# Altium schematic sheet LED MODULE.SchDoc
size A4
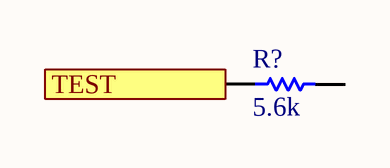
[diagram p0: LED MODULE.SchDoc]

## Parts
R?  5.6k  [0805]

## Ports
TEST

## Nets
TEST: R?.1 ; port TEST

Not connected (* = marked no-connect by the designer): R? 2

## Library data of the parts
R? = RC0805FR075K6L: Manufacturer: YAGEO; Tolerance: 0.01; Rated Voltage: 0.125W; Part Number: RC0805FR075K6L; Value: 5.6k; Material: FR-07; Digikey Part Number: 311-5.60KCRCT-ND